# EAGLE schematic tube_driver_eagle (EAGLE 6.4)
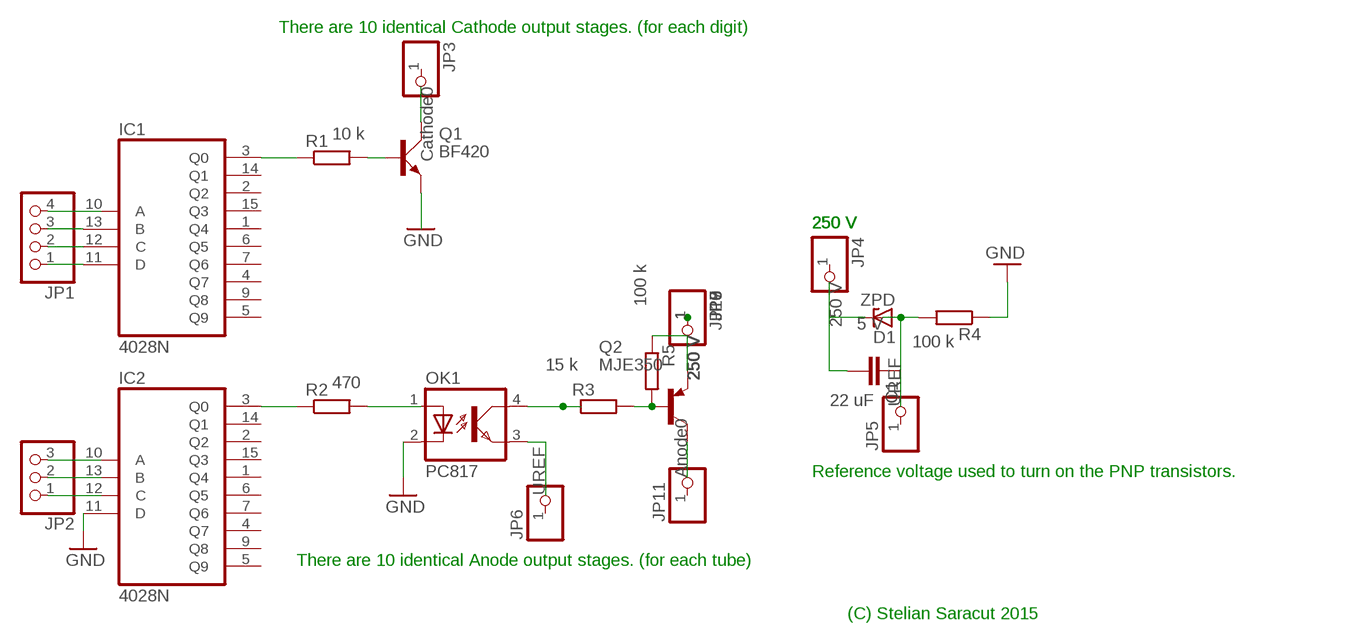
[diagram p0: schematic, sheet 1]

## Parts
C1  C2,5-3  [C2.5-3]
D1  ZPD  [DO35Z10]
IC1  4028N  [DIL16]
IC2  4028N  [DIL16]
JP1  PINHD-1X4  [1X04]
JP2  PINHD-1X3  [1X03]
JP3  PINHD-1X1  [1X01]
JP4  PINHD-1X1  [1X01]
JP5  PINHD-1X1  [1X01]
JP6  PINHD-1X1  [1X01]
JP7  PINHD-1X1  [1X01]
JP8  PINHD-1X1  [1X01]
JP9  PINHD-1X1  [1X01]
JP10  PINHD-1X1  [1X01]
JP11  PINHD-1X1  [1X01]
OK1  PC817  [DIL04]
Q1  BF420  [SOT54D]
Q2  MJE350  [TO126]
R1  R-EU_0204/2V  [0204V]
R2  R-EU_0204/2V  [0204V]
R3  R-EU_0204/2V  [0204V]
R4  R-EU_0204/2V  [0204V]
R5  R-EU_0204/2V  [0204V]

## Nets
GND: IC2.11(D) OK1.2(C) Q1.E R4.1
N$1: IC1.3(Q0) R1.1
N$2: Q1.B R1.2
N$3: Q1.C
N$4: JP1.4
N$5: IC1.13(B) JP1.3
N$6: IC1.12(C) JP1.2
N$7: IC1.11(D) JP1.1
N$8: JP2.3
N$9: JP2.2
N$10: JP2.1
N$11: IC2.3(Q0) R2.1
N$12: R2.2
N$13: C1.2 D1.C
N$14: C1.1 D1.A R4.2
N$15: OK1.4(COL) R3.1
N$16: Q2.3(B) R3.2 R5.2
N$17: JP7.1 JP8.1 JP9.1 JP10.1
N$18: Q2.1(E) R5.1
N$19: OK1.3(EMIT)
N$20: Q2.2(C)
Unconnected: IC1.1(Q4) IC1.2(Q2) IC1.4(Q7) IC1.5(Q9) IC1.6(Q5) IC1.7(Q6) IC1.9(Q8) IC1.10(A) IC1.14(Q1) IC1.15(Q3) IC2.1(Q4) IC2.2(Q2) IC2.4(Q7) IC2.5(Q9) IC2.6(Q5) IC2.7(Q6) IC2.9(Q8) IC2.10(A) IC2.12(C) IC2.13(B) IC2.14(Q1) IC2.15(Q3) JP3.1 JP4.1 JP5.1 JP6.1 JP11.1 OK1.1(A)

## Notes on the sheet
- There are 10 identical Cathode output stages. (for each digit)
- 250 V | 250 V | 250 V
- Reference voltage used to turn on the PNP transistors.
- There are 10 identical Anode output stages. (for each tube)
- (C) Stelian Saracut 2015

## Power pins joined to a net without a drawn wire
VDD: IC1.16(VDD) IC2.16(VDD)
VSS: IC1.8(VSS) IC2.8(VSS)

## Library data of the parts
C1 = capacitor-wima:C: CAPACITOR naming: grid - package width; C1: 22 uF
D1 = diode:ZPD: Z DIODE 500 mW; ZD1: 5 V
IC1 IC2 = 40xx:4028: BCD to decimal DECODER
JP1 = pinhead:PINHD-1X4: PIN HEADER
JP2 = pinhead:PINHD-1X3: PIN HEADER
JP3 = pinhead:PINHD-1X1: PIN HEADER; P0: Cathode0
JP4 JP7-JP10 = pinhead:PINHD-1X1: PIN HEADER; JP4: 250 V
JP5 JP6 = pinhead:PINHD-1X1: PIN HEADER; JP4: UREF
JP11 = pinhead:PINHD-1X1: PIN HEADER; JP4: Anode0
OK1 = optocoupler:PC817: SHARP OPTO COUPLER; MPN: PC817X4J000F; OC_FARNELL: 9707727; OC_NEWARK: 97K7059
Q1 = transistor-small-signal:BF420: NPN TRANSISTOR
Q2 = transistor-pnp:MJE350: PNP Transistor
R1 = resistor:R-EU_: RESISTOR, European symbol; R1: 10 k
R2 = resistor:R-EU_: RESISTOR, European symbol; R2: 470
R3 = resistor:R-EU_: RESISTOR, European symbol; R1: 15 k
R4 R5 = resistor:R-EU_: RESISTOR, European symbol; R1: 100 k